# EAGLE design DIY_Keyboard_V1.4 (EAGLE 7.7.0)
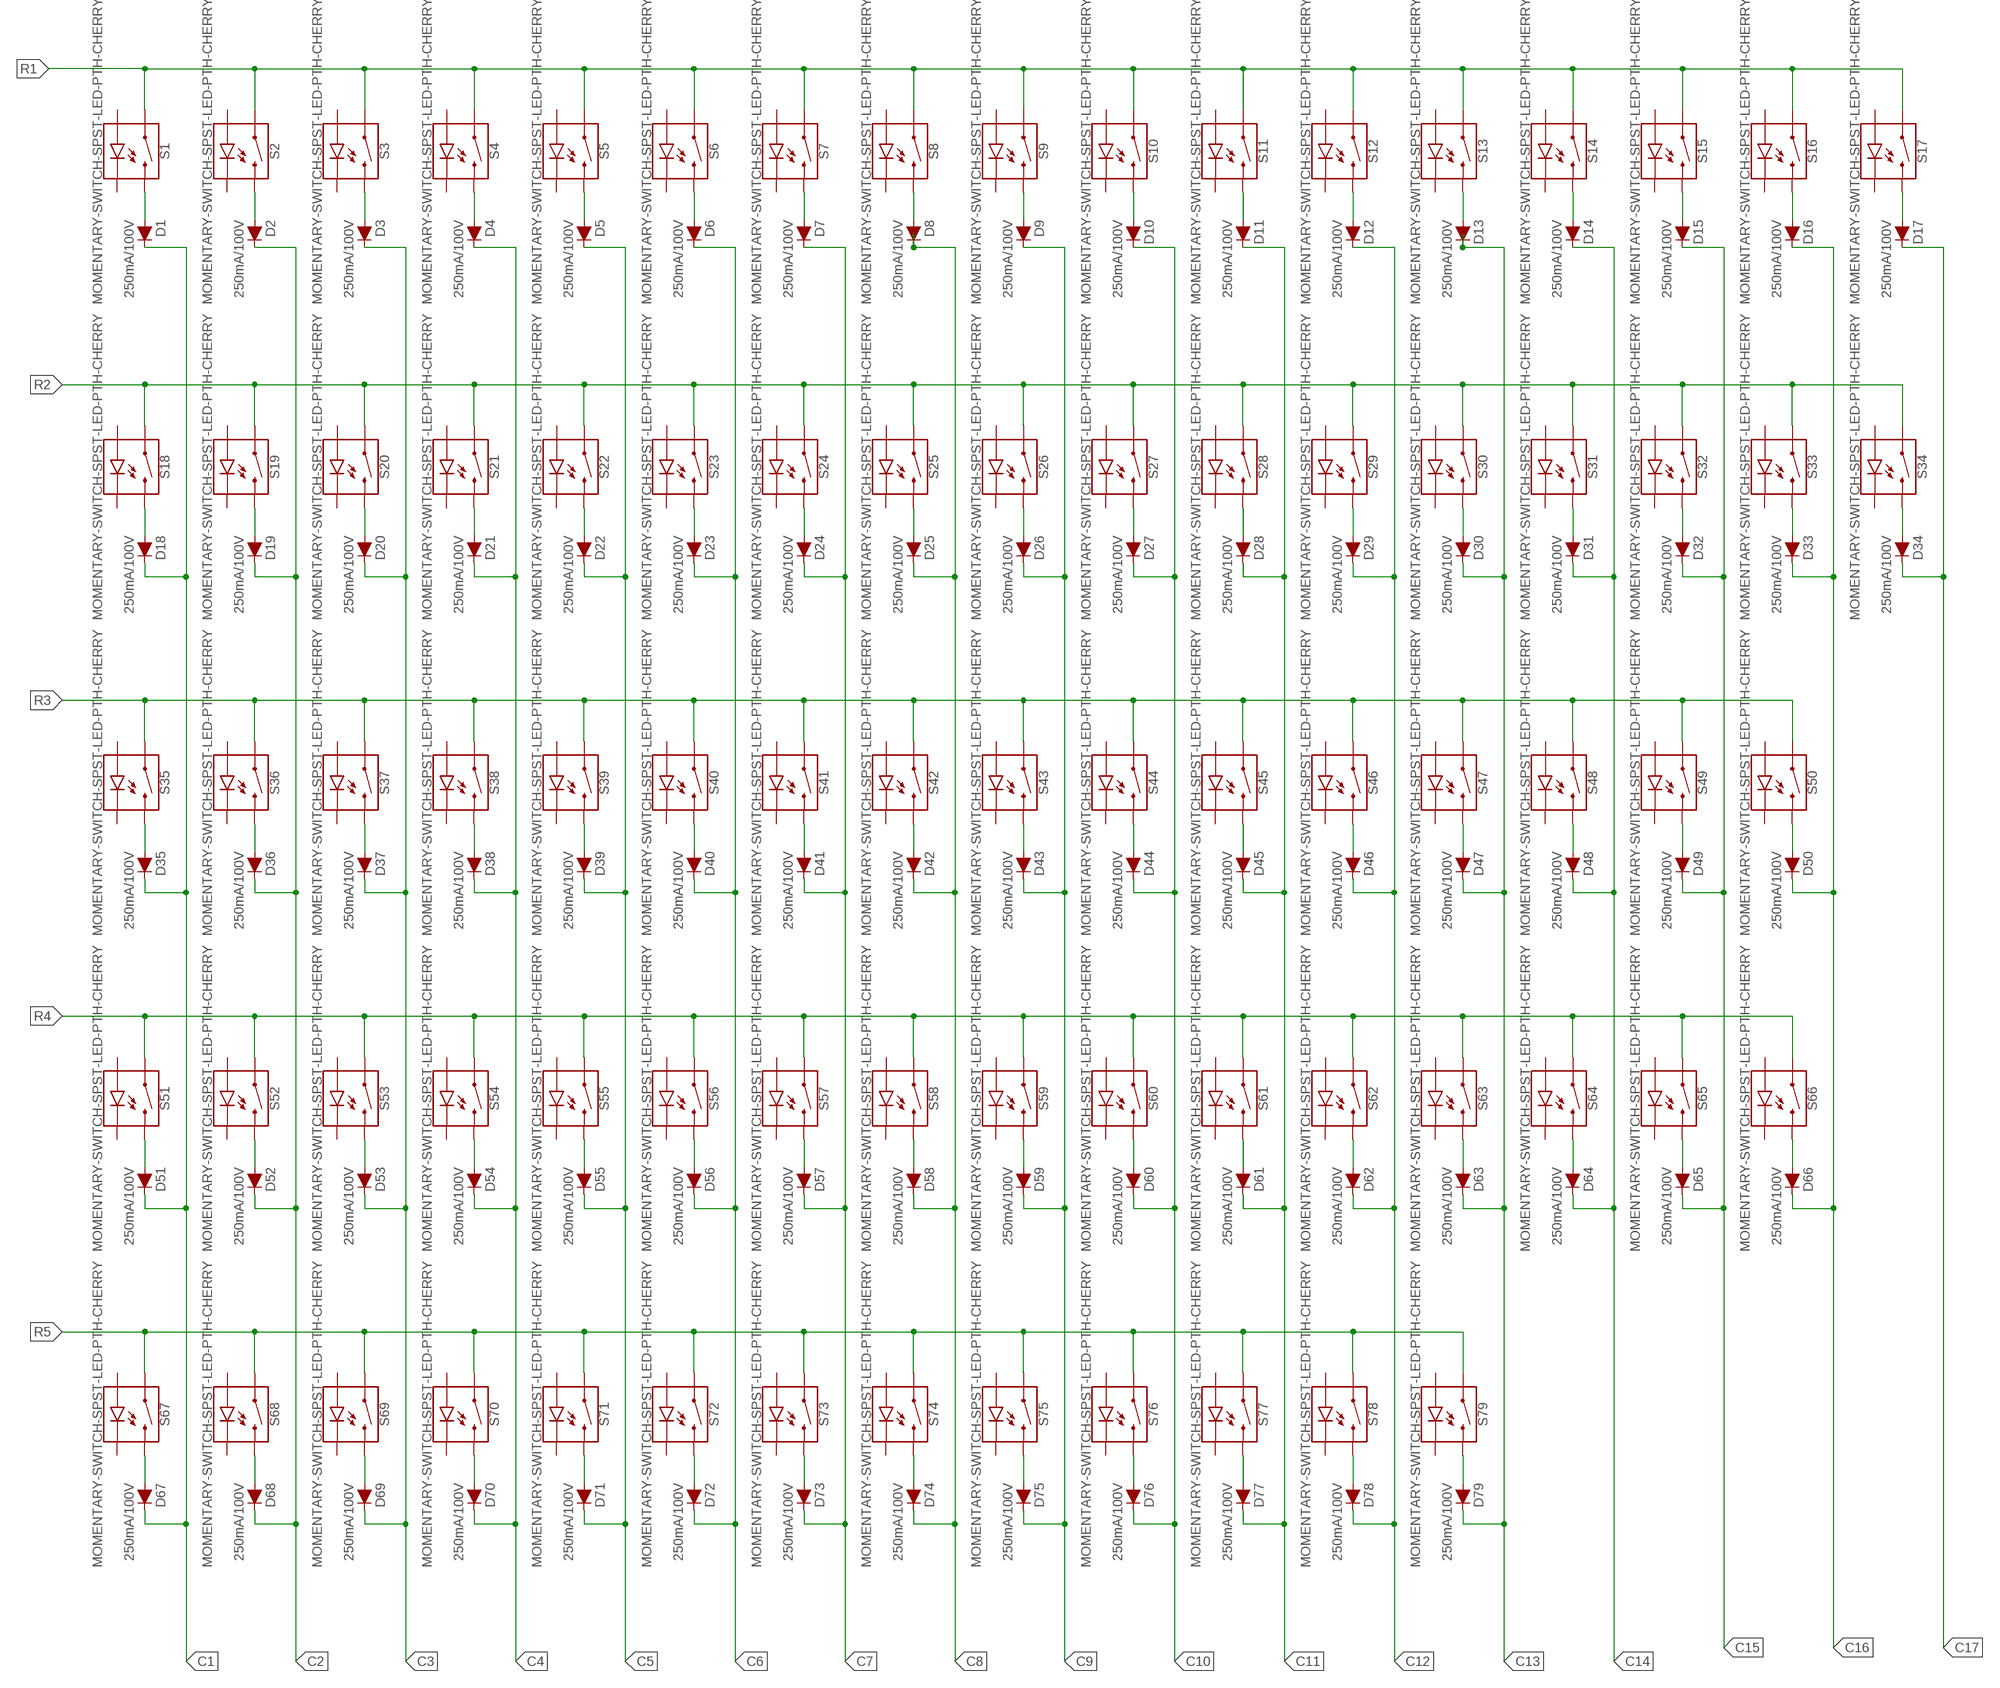
[diagram p0: schematic, sheet 1, part 1 of 2]
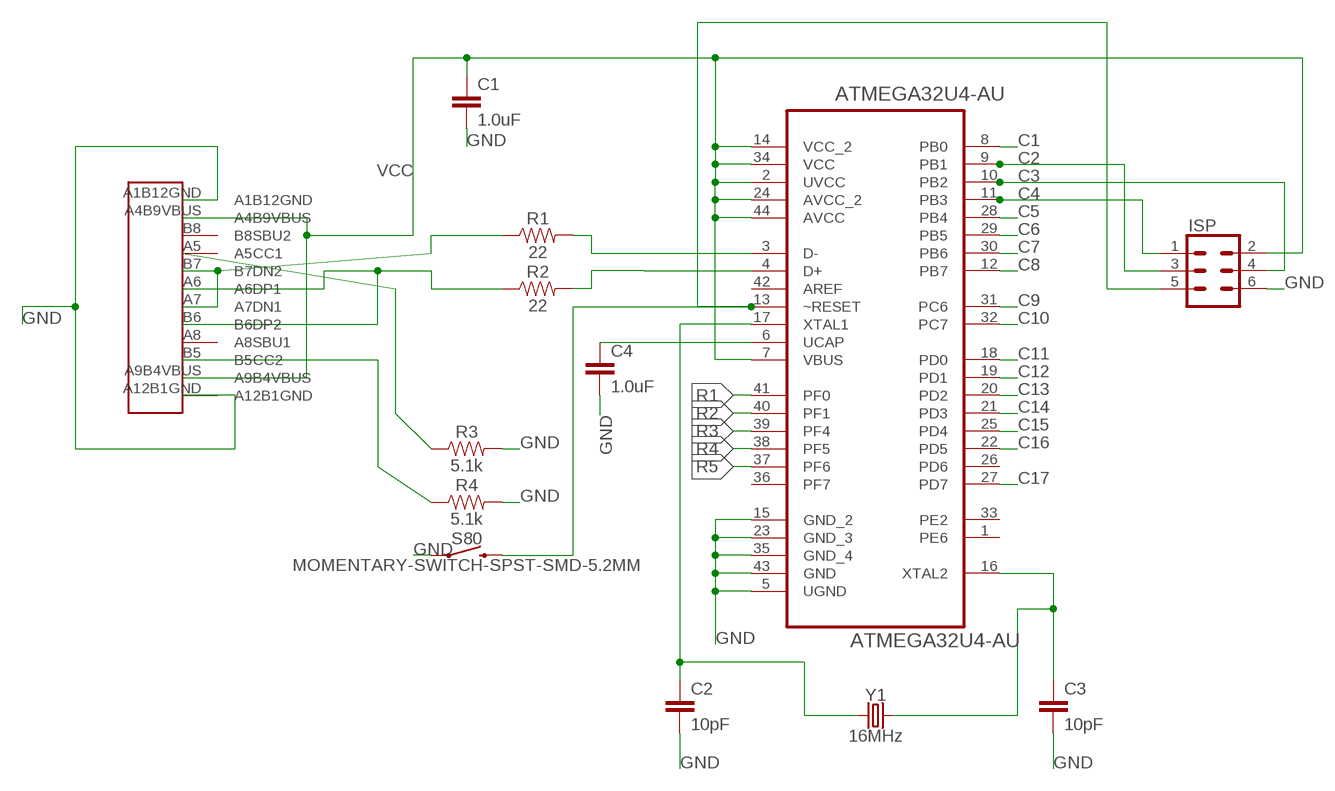
[diagram p1: schematic, sheet 1, part 2 of 2]

## Parts
ATMEGA32U4-AU  ATMEGA32U4-AU  [QFP80P1200X1200X120-44N]
C1  1.0uF  1.0UF-0603-16V-10%  [0603]
C2  10pF  10PF-0603-50V-5%  [0603]
C3  10pF  10PF-0603-50V-5%  [0603]
C4  1.0uF  1.0UF-0603-16V-10%  [0603]
D1  250mA/100V  DIODE-BAS16J  [SOD-323]
D2  250mA/100V  DIODE-BAS16J  [SOD-323]
D3  250mA/100V  DIODE-BAS16J  [SOD-323]
D4  250mA/100V  DIODE-BAS16J  [SOD-323]
D5  250mA/100V  DIODE-BAS16J  [SOD-323]
D6  250mA/100V  DIODE-BAS16J  [SOD-323]
D7  250mA/100V  DIODE-BAS16J  [SOD-323]
D8  250mA/100V  DIODE-BAS16J  [SOD-323]
D9  250mA/100V  DIODE-BAS16J  [SOD-323]
D10  250mA/100V  DIODE-BAS16J  [SOD-323]
D11  250mA/100V  DIODE-BAS16J  [SOD-323]
D12  250mA/100V  DIODE-BAS16J  [SOD-323]
D13  250mA/100V  DIODE-BAS16J  [SOD-323]
D14  250mA/100V  DIODE-BAS16J  [SOD-323]
D15  250mA/100V  DIODE-BAS16J  [SOD-323]
D16  250mA/100V  DIODE-BAS16J  [SOD-323]
D17  250mA/100V  DIODE-BAS16J  [SOD-323]
D18  250mA/100V  DIODE-BAS16J  [SOD-323]
D19  250mA/100V  DIODE-BAS16J  [SOD-323]
D20  250mA/100V  DIODE-BAS16J  [SOD-323]
D21  250mA/100V  DIODE-BAS16J  [SOD-323]
D22  250mA/100V  DIODE-BAS16J  [SOD-323]
D23  250mA/100V  DIODE-BAS16J  [SOD-323]
D24  250mA/100V  DIODE-BAS16J  [SOD-323]
D25  250mA/100V  DIODE-BAS16J  [SOD-323]
D26  250mA/100V  DIODE-BAS16J  [SOD-323]
D27  250mA/100V  DIODE-BAS16J  [SOD-323]
D28  250mA/100V  DIODE-BAS16J  [SOD-323]
D29  250mA/100V  DIODE-BAS16J  [SOD-323]
D30  250mA/100V  DIODE-BAS16J  [SOD-323]
D31  250mA/100V  DIODE-BAS16J  [SOD-323]
D32  250mA/100V  DIODE-BAS16J  [SOD-323]
D33  250mA/100V  DIODE-BAS16J  [SOD-323]
D34  250mA/100V  DIODE-BAS16J  [SOD-323]
D35  250mA/100V  DIODE-BAS16J  [SOD-323]
D36  250mA/100V  DIODE-BAS16J  [SOD-323]
D37  250mA/100V  DIODE-BAS16J  [SOD-323]
D38  250mA/100V  DIODE-BAS16J  [SOD-323]
D39  250mA/100V  DIODE-BAS16J  [SOD-323]
D40  250mA/100V  DIODE-BAS16J  [SOD-323]
D41  250mA/100V  DIODE-BAS16J  [SOD-323]
D42  250mA/100V  DIODE-BAS16J  [SOD-323]
D43  250mA/100V  DIODE-BAS16J  [SOD-323]
D44  250mA/100V  DIODE-BAS16J  [SOD-323]
D45  250mA/100V  DIODE-BAS16J  [SOD-323]
D46  250mA/100V  DIODE-BAS16J  [SOD-323]
D47  250mA/100V  DIODE-BAS16J  [SOD-323]
D48  250mA/100V  DIODE-BAS16J  [SOD-323]
D49  250mA/100V  DIODE-BAS16J  [SOD-323]
D50  250mA/100V  DIODE-BAS16J  [SOD-323]
D51  250mA/100V  DIODE-BAS16J  [SOD-323]
D52  250mA/100V  DIODE-BAS16J  [SOD-323]
D53  250mA/100V  DIODE-BAS16J  [SOD-323]
D54  250mA/100V  DIODE-BAS16J  [SOD-323]
D55  250mA/100V  DIODE-BAS16J  [SOD-323]
D56  250mA/100V  DIODE-BAS16J  [SOD-323]
D57  250mA/100V  DIODE-BAS16J  [SOD-323]
D58  250mA/100V  DIODE-BAS16J  [SOD-323]
D59  250mA/100V  DIODE-BAS16J  [SOD-323]
D60  250mA/100V  DIODE-BAS16J  [SOD-323]
D61  250mA/100V  DIODE-BAS16J  [SOD-323]
D62  250mA/100V  DIODE-BAS16J  [SOD-323]
D63  250mA/100V  DIODE-BAS16J  [SOD-323]
D64  250mA/100V  DIODE-BAS16J  [SOD-323]
D65  250mA/100V  DIODE-BAS16J  [SOD-323]
D66  250mA/100V  DIODE-BAS16J  [SOD-323]
D67  250mA/100V  DIODE-BAS16J  [SOD-323]
D68  250mA/100V  DIODE-BAS16J  [SOD-323]
D69  250mA/100V  DIODE-BAS16J  [SOD-323]
D70  250mA/100V  DIODE-BAS16J  [SOD-323]
D71  250mA/100V  DIODE-BAS16J  [SOD-323]
D72  250mA/100V  DIODE-BAS16J  [SOD-323]
D73  250mA/100V  DIODE-BAS16J  [SOD-323]
D74  250mA/100V  DIODE-BAS16J  [SOD-323]
D75  250mA/100V  DIODE-BAS16J  [SOD-323]
D76  250mA/100V  DIODE-BAS16J  [SOD-323]
D77  250mA/100V  DIODE-BAS16J  [SOD-323]
D78  250mA/100V  DIODE-BAS16J  [SOD-323]
D79  250mA/100V  DIODE-BAS16J  [SOD-323]
ISP  CONN_03X2FEMALE  [2X3]
R1  22  22OHM-0603-1/10W-1%  [0603]
R2  22  22OHM-0603-1/10W-1%  [0603]
R3  5.1k  56KOHM  [0603]
R4  5.1k  56KOHM  [0603]
S1  MOMENTARY-SWITCH-SPST-LED-PTH-CHERRY  [CHERRY-MX-LED]
S2  MOMENTARY-SWITCH-SPST-LED-PTH-CHERRY  [CHERRY-MX-LED]
S3  MOMENTARY-SWITCH-SPST-LED-PTH-CHERRY  [CHERRY-MX-LED]
S4  MOMENTARY-SWITCH-SPST-LED-PTH-CHERRY  [CHERRY-MX-LED]
S5  MOMENTARY-SWITCH-SPST-LED-PTH-CHERRY  [CHERRY-MX-LED]
S6  MOMENTARY-SWITCH-SPST-LED-PTH-CHERRY  [CHERRY-MX-LED]
S7  MOMENTARY-SWITCH-SPST-LED-PTH-CHERRY  [CHERRY-MX-LED]
S8  MOMENTARY-SWITCH-SPST-LED-PTH-CHERRY  [CHERRY-MX-LED]
S9  MOMENTARY-SWITCH-SPST-LED-PTH-CHERRY  [CHERRY-MX-LED]
S10  MOMENTARY-SWITCH-SPST-LED-PTH-CHERRY  [CHERRY-MX-LED]
S11  MOMENTARY-SWITCH-SPST-LED-PTH-CHERRY  [CHERRY-MX-LED]
S12  MOMENTARY-SWITCH-SPST-LED-PTH-CHERRY  [CHERRY-MX-LED]
S13  MOMENTARY-SWITCH-SPST-LED-PTH-CHERRY  [CHERRY-MX-LED]
S14  MOMENTARY-SWITCH-SPST-LED-PTH-CHERRY  [CHERRY-MX-LED]
S15  MOMENTARY-SWITCH-SPST-LED-PTH-CHERRY  [CHERRY-MX-LED]
S16  MOMENTARY-SWITCH-SPST-LED-PTH-CHERRY  [CHERRY-MX-LED]
S17  MOMENTARY-SWITCH-SPST-LED-PTH-CHERRY  [CHERRY-MX-LED]
S18  MOMENTARY-SWITCH-SPST-LED-PTH-CHERRY  [CHERRY-MX-LED]
S19  MOMENTARY-SWITCH-SPST-LED-PTH-CHERRY  [CHERRY-MX-LED]
S20  MOMENTARY-SWITCH-SPST-LED-PTH-CHERRY  [CHERRY-MX-LED]
S21  MOMENTARY-SWITCH-SPST-LED-PTH-CHERRY  [CHERRY-MX-LED]
S22  MOMENTARY-SWITCH-SPST-LED-PTH-CHERRY  [CHERRY-MX-LED]
S23  MOMENTARY-SWITCH-SPST-LED-PTH-CHERRY  [CHERRY-MX-LED]
S24  MOMENTARY-SWITCH-SPST-LED-PTH-CHERRY  [CHERRY-MX-LED]
S25  MOMENTARY-SWITCH-SPST-LED-PTH-CHERRY  [CHERRY-MX-LED]
S26  MOMENTARY-SWITCH-SPST-LED-PTH-CHERRY  [CHERRY-MX-LED]
S27  MOMENTARY-SWITCH-SPST-LED-PTH-CHERRY  [CHERRY-MX-LED]
S28  MOMENTARY-SWITCH-SPST-LED-PTH-CHERRY  [CHERRY-MX-LED]
S29  MOMENTARY-SWITCH-SPST-LED-PTH-CHERRY  [CHERRY-MX-LED]
S30  MOMENTARY-SWITCH-SPST-LED-PTH-CHERRY  [CHERRY-MX-LED]
S31  MOMENTARY-SWITCH-SPST-LED-PTH-CHERRY  [CHERRY-MX-LED]
S32  MOMENTARY-SWITCH-SPST-LED-PTH-CHERRY  [CHERRY-MX-LED]
S33  MOMENTARY-SWITCH-SPST-LED-PTH-CHERRY  [CHERRY-MX-LED]
S34  MOMENTARY-SWITCH-SPST-LED-PTH-CHERRY  [CHERRY-MX-LED]
S35  MOMENTARY-SWITCH-SPST-LED-PTH-CHERRY  [CHERRY-MX-LED]
S36  MOMENTARY-SWITCH-SPST-LED-PTH-CHERRY  [CHERRY-MX-LED]
S37  MOMENTARY-SWITCH-SPST-LED-PTH-CHERRY  [CHERRY-MX-LED]
S38  MOMENTARY-SWITCH-SPST-LED-PTH-CHERRY  [CHERRY-MX-LED]
S39  MOMENTARY-SWITCH-SPST-LED-PTH-CHERRY  [CHERRY-MX-LED]
S40  MOMENTARY-SWITCH-SPST-LED-PTH-CHERRY  [CHERRY-MX-LED]
S41  MOMENTARY-SWITCH-SPST-LED-PTH-CHERRY  [CHERRY-MX-LED]
S42  MOMENTARY-SWITCH-SPST-LED-PTH-CHERRY  [CHERRY-MX-LED]
S43  MOMENTARY-SWITCH-SPST-LED-PTH-CHERRY  [CHERRY-MX-LED]
S44  MOMENTARY-SWITCH-SPST-LED-PTH-CHERRY  [CHERRY-MX-LED]
S45  MOMENTARY-SWITCH-SPST-LED-PTH-CHERRY  [CHERRY-MX-LED]
S46  MOMENTARY-SWITCH-SPST-LED-PTH-CHERRY  [CHERRY-MX-LED]
S47  MOMENTARY-SWITCH-SPST-LED-PTH-CHERRY  [CHERRY-MX-LED]
S48  MOMENTARY-SWITCH-SPST-LED-PTH-CHERRY  [CHERRY-MX-LED]
S49  MOMENTARY-SWITCH-SPST-LED-PTH-CHERRY  [CHERRY-MX-LED]
S50  MOMENTARY-SWITCH-SPST-LED-PTH-CHERRY  [CHERRY-MX-LED]
S51  MOMENTARY-SWITCH-SPST-LED-PTH-CHERRY  [CHERRY-MX-LED]
S52  MOMENTARY-SWITCH-SPST-LED-PTH-CHERRY  [CHERRY-MX-LED]
S53  MOMENTARY-SWITCH-SPST-LED-PTH-CHERRY  [CHERRY-MX-LED]
S54  MOMENTARY-SWITCH-SPST-LED-PTH-CHERRY  [CHERRY-MX-LED]
S55  MOMENTARY-SWITCH-SPST-LED-PTH-CHERRY  [CHERRY-MX-LED]
S56  MOMENTARY-SWITCH-SPST-LED-PTH-CHERRY  [CHERRY-MX-LED]
S57  MOMENTARY-SWITCH-SPST-LED-PTH-CHERRY  [CHERRY-MX-LED]
S58  MOMENTARY-SWITCH-SPST-LED-PTH-CHERRY  [CHERRY-MX-LED]
S59  MOMENTARY-SWITCH-SPST-LED-PTH-CHERRY  [CHERRY-MX-LED]
S60  MOMENTARY-SWITCH-SPST-LED-PTH-CHERRY  [CHERRY-MX-LED]
S61  MOMENTARY-SWITCH-SPST-LED-PTH-CHERRY  [CHERRY-MX-LED]
S62  MOMENTARY-SWITCH-SPST-LED-PTH-CHERRY  [CHERRY-MX-LED]
S63  MOMENTARY-SWITCH-SPST-LED-PTH-CHERRY  [CHERRY-MX-LED]
S64  MOMENTARY-SWITCH-SPST-LED-PTH-CHERRY  [CHERRY-MX-LED]
S65  MOMENTARY-SWITCH-SPST-LED-PTH-CHERRY  [CHERRY-MX-LED]
S66  MOMENTARY-SWITCH-SPST-LED-PTH-CHERRY  [CHERRY-MX-LED]
S67  MOMENTARY-SWITCH-SPST-LED-PTH-CHERRY  [CHERRY-MX-LED]
S68  MOMENTARY-SWITCH-SPST-LED-PTH-CHERRY  [CHERRY-MX-LED]
S69  MOMENTARY-SWITCH-SPST-LED-PTH-CHERRY  [CHERRY-MX-LED]
S70  MOMENTARY-SWITCH-SPST-LED-PTH-CHERRY  [CHERRY-MX-LED]
S71  MOMENTARY-SWITCH-SPST-LED-PTH-CHERRY  [CHERRY-MX-LED]
S72  MOMENTARY-SWITCH-SPST-LED-PTH-CHERRY  [CHERRY-MX-LED]
S73  MOMENTARY-SWITCH-SPST-LED-PTH-CHERRY  [CHERRY-MX-LED]
S74  MOMENTARY-SWITCH-SPST-LED-PTH-CHERRY  [CHERRY-MX-LED]
S75  MOMENTARY-SWITCH-SPST-LED-PTH-CHERRY  [CHERRY-MX-LED]
S76  MOMENTARY-SWITCH-SPST-LED-PTH-CHERRY  [CHERRY-MX-LED]
S77  MOMENTARY-SWITCH-SPST-LED-PTH-CHERRY  [CHERRY-MX-LED]
S78  MOMENTARY-SWITCH-SPST-LED-PTH-CHERRY  [CHERRY-MX-LED]
S79  MOMENTARY-SWITCH-SPST-LED-PTH-CHERRY  [CHERRY-MX-LED]
S80  MOMENTARY-SWITCH-SPST-SMD-5.2MM  [TACTILE_SWITCH_SMD_5.2MM]
U$1  USB_TYPE_C  [USB_TYPE_C]
Y1  16MHz  CRYSTAL-16MHZSMD-5X3.2  [CRYSTAL-SMD-5X3.2-4PAD]

## Nets
C1: ATMEGA32U4-AU.8(PB0) D1.C D18.C D35.C D51.C D67.C
C2: ATMEGA32U4-AU.9(PB1) D2.C D19.C D36.C D52.C D68.C ISP.3
C3: ATMEGA32U4-AU.10(PB2) D3.C D20.C D37.C D53.C D69.C ISP.4
C4: ATMEGA32U4-AU.11(PB3) D4.C D21.C D38.C D54.C D70.C ISP.1
C5: ATMEGA32U4-AU.28(PB4) D5.C D22.C D39.C D55.C D71.C
C6: ATMEGA32U4-AU.29(PB5) D6.C D23.C D40.C D56.C D72.C
C7: ATMEGA32U4-AU.30(PB6) D7.C D24.C D41.C D57.C D73.C
C8: ATMEGA32U4-AU.12(PB7) D8.C D25.C D42.C D58.C D74.C
C9: ATMEGA32U4-AU.31(PC6) D9.C D26.C D43.C D59.C D75.C
C10: ATMEGA32U4-AU.32(PC7) D10.C D27.C D44.C D60.C D76.C
C11: ATMEGA32U4-AU.18(PD0) D11.C D28.C D45.C D61.C D77.C
C12: ATMEGA32U4-AU.19(PD1) D12.C D29.C D46.C D62.C D78.C
C13: ATMEGA32U4-AU.20(PD2) D13.C D30.C D47.C D63.C D79.C
C14: ATMEGA32U4-AU.21(PD3) D14.C D31.C D48.C D64.C
C15: ATMEGA32U4-AU.25(PD4) D15.C D32.C D49.C D65.C
C16: ATMEGA32U4-AU.22(PD5) D16.C D33.C D50.C D66.C
C17: ATMEGA32U4-AU.27(PD7) D17.C D34.C
GND: ATMEGA32U4-AU.5(UGND) ATMEGA32U4-AU.15(GND_2) ATMEGA32U4-AU.23(GND_3) ATMEGA32U4-AU.35(GND_4) ATMEGA32U4-AU.43(GND) C1.2 C2.2 C3.2 C4.2 ISP.6 R3.2 R4.2 S80.1 U$1.A1B12GND U$1.A12B1GND
N$1: D1.A S1.S2
N$2: D2.A S2.S2
N$3: D3.A S3.S2
N$4: D4.A S4.S2
N$5: D5.A S5.S2
N$6: D6.A S6.S2
N$7: D7.A S7.S2
N$8: D8.A S8.S2
N$9: D9.A S9.S2
N$10: D10.A S10.S2
N$11: D11.A S11.S2
N$12: D12.A S12.S2
N$13: D13.A S13.S2
N$14: D14.A S14.S2
N$15: D15.A S15.S2
N$16: D16.A S16.S2
N$17: D17.A S17.S2
N$18: D18.A S18.S2
N$19: D19.A S19.S2
N$20: D20.A S20.S2
N$21: D21.A S21.S2
N$22: D22.A S22.S2
N$23: D23.A S23.S2
N$24: D24.A S24.S2
N$25: D25.A S25.S2
N$26: D26.A S26.S2
N$27: D27.A S27.S2
N$28: D28.A S28.S2
N$29: D29.A S29.S2
N$30: D30.A S30.S2
N$31: D31.A S31.S2
N$32: D32.A S32.S2
N$33: D33.A S33.S2
N$34: D34.A S34.S2
N$35: D35.A S35.S2
N$36: D36.A S36.S2
N$37: D37.A S37.S2
N$38: D38.A S38.S2
N$39: D39.A S39.S2
N$40: D40.A S40.S2
N$41: D41.A S41.S2
N$42: D42.A S42.S2
N$43: D43.A S43.S2
N$44: D44.A S44.S2
N$45: D45.A S45.S2
N$46: D46.A S46.S2
N$47: D47.A S47.S2
N$48: D48.A S48.S2
N$49: D49.A S49.S2
N$50: D50.A S50.S2
N$51: D51.A S51.S2
N$52: D52.A S52.S2
N$53: D53.A S53.S2
N$54: D54.A S54.S2
N$55: D55.A S55.S2
N$56: D56.A S56.S2
N$57: D57.A S57.S2
N$58: D58.A S58.S2
N$59: D59.A S59.S2
N$60: D60.A S60.S2
N$61: D61.A S61.S2
N$62: D62.A S62.S2
N$63: D63.A S63.S2
N$64: D64.A S64.S2
N$65: D65.A S65.S2
N$66: D66.A S66.S2
N$67: D67.A S67.S2
N$68: D68.A S68.S2
N$69: D69.A S69.S2
N$70: D70.A S70.S2
N$71: D71.A S71.S2
N$72: D72.A S72.S2
N$73: D73.A S73.S2
N$74: D74.A S74.S2
N$75: D75.A S75.S2
N$76: D76.A S76.S2
N$77: D77.A S77.S2
N$78: D78.A S78.S2
N$79: D79.A S79.S2
N$80: ATMEGA32U4-AU.3(D-) R1.2
N$81: ATMEGA32U4-AU.4(D+) R2.2
N$82: R1.1 U$1.A7(A7DN1) U$1.B7(B7DN2)
N$84: R2.1 U$1.A6(A6DP1) U$1.B6(B6DP2)
N$85: ATMEGA32U4-AU.13(~RESET) ISP.5 S80.3
N$86: ATMEGA32U4-AU.16(XTAL2) C3.1 Y1.3
N$87: ATMEGA32U4-AU.17(XTAL1) C2.1 Y1.1
N$88: R3.1 U$1.A5(A5CC1)
N$89: R4.1 U$1.B5(B5CC2)
N$92: ATMEGA32U4-AU.6(UCAP) C4.1
R1: ATMEGA32U4-AU.41(PF0) S1.S1 S2.S1 S3.S1 S4.S1 S5.S1 S6.S1 S7.S1 S8.S1 S9.S1 S10.S1 S11.S1 S12.S1 S13.S1 S14.S1 S15.S1 S16.S1 S17.S1
R2: ATMEGA32U4-AU.40(PF1) S18.S1 S19.S1 S20.S1 S21.S1 S22.S1 S23.S1 S24.S1 S25.S1 S26.S1 S27.S1 S28.S1 S29.S1 S30.S1 S31.S1 S32.S1 S33.S1 S34.S1
R3: ATMEGA32U4-AU.39(PF4) S35.S1 S36.S1 S37.S1 S38.S1 S39.S1 S40.S1 S41.S1 S42.S1 S43.S1 S44.S1 S45.S1 S46.S1 S47.S1 S48.S1 S49.S1 S50.S1
R4: ATMEGA32U4-AU.38(PF5) S51.S1 S52.S1 S53.S1 S54.S1 S55.S1 S56.S1 S57.S1 S58.S1 S59.S1 S60.S1 S61.S1 S62.S1 S63.S1 S64.S1 S65.S1 S66.S1
R5: ATMEGA32U4-AU.37(PF6) S67.S1 S68.S1 S69.S1 S70.S1 S71.S1 S72.S1 S73.S1 S74.S1 S75.S1 S76.S1 S77.S1 S78.S1 S79.S1
VCC: ATMEGA32U4-AU.2(UVCC) ATMEGA32U4-AU.7(VBUS) ATMEGA32U4-AU.14(VCC_2) ATMEGA32U4-AU.24(AVCC_2) ATMEGA32U4-AU.34(VCC) ATMEGA32U4-AU.44(AVCC) C1.1 ISP.2 U$1.A4B9VBUS U$1.A9B4VBUS
Unconnected: ATMEGA32U4-AU.1(PE6) ATMEGA32U4-AU.26(PD6) ATMEGA32U4-AU.33(PE2) ATMEGA32U4-AU.36(PF7) ATMEGA32U4-AU.42(AREF) S1.A S1.K(C) S2.A S2.K(C) S3.A S3.K(C) S4.A S4.K(C) S5.A S5.K(C) S6.A S6.K(C) S7.A S7.K(C) S8.A S8.K(C) S9.A S9.K(C) S10.A S10.K(C) S11.A S11.K(C) S12.A S12.K(C) S13.A S13.K(C) S14.A S14.K(C) S15.A S15.K(C) S16.A S16.K(C) S17.A S17.K(C) S18.A S18.K(C) S19.A S19.K(C) S20.A S20.K(C) S21.A S21.K(C) S22.A S22.K(C) S23.A S23.K(C) S24.A S24.K(C) S25.A S25.K(C) S26.A S26.K(C) S27.A S27.K(C) S28.A S28.K(C) S29.A S29.K(C) S30.A S30.K(C) S31.A S31.K(C) S32.A S32.K(C) S33.A S33.K(C) S34.A S34.K(C) S35.A S35.K(C) S36.A S36.K(C) S37.A S37.K(C) S38.A S38.K(C) S39.A S39.K(C) S40.A S40.K(C) S41.A S41.K(C) S42.A S42.K(C) S43.A S43.K(C) S44.A S44.K(C) S45.A S45.K(C) S46.A S46.K(C) S47.A S47.K(C) S48.A S48.K(C) S49.A S49.K(C) S50.A S50.K(C) S51.A S51.K(C) S52.A S52.K(C) S53.A S53.K(C) S54.A S54.K(C) S55.A S55.K(C) S56.A S56.K(C) S57.A S57.K(C) S58.A S58.K(C) S59.A S59.K(C) S60.A S60.K(C) S61.A S61.K(C) S62.A S62.K(C) S63.A S63.K(C) S64.A S64.K(C) S65.A S65.K(C) S66.A S66.K(C) S67.A S67.K(C) S68.A S68.K(C) S69.A S69.K(C) S70.A S70.K(C) S71.A S71.K(C) S72.A S72.K(C) S73.A S73.K(C) S74.A S74.K(C) S75.A S75.K(C) S76.A S76.K(C) S77.A S77.K(C) S78.A S78.K(C) S79.A S79.K(C) U$1.A8(A8SBU1) U$1.B8(B8SBU2)

## Library data of the parts
ATMEGA32U4-AU = ATMEGA32U4-AU:ATMEGA32U4-AU: 8-bit Microcontroller with ISP Flash and USB Controller; AVAILABILITY: Unavailable; DESCRIPTION: MCU 8-bit ATmega AVR RISC 32KB Flash 3.3V/5V 44-Pin TQFP; MF: Microchip; MP: ATMEGA32U4-AU; PACKAGE: TQFP-44 Microchip; PRICE: None
C1 C4 = SparkFun-Capacitors:1.0UF: 1µF ceramic capacitors A capacitor is a passive two-terminal electrical component used to store electrical energy temporarily in an electric field.; PROD_ID: CAP-00868
C2 C3 = SparkFun-Capacitors:10PF: 10pF ceramic capacitors A capacitor is a passive two-terminal electrical component used to store electrical energy temporarily in an electric field.; PROD_ID: CAP-11812
D1-D79 = SparkFun-DiscreteSemi:DIODE: Diode These are standard reverse protection diodes and small signal diodes. SparkFun Products: SparkFun SparkPunk Sound Kit <https://www.sparkfun.com/products/11177> SparkFun ESP8266 Thing <https://www.sparkfun.com/products/13231>; PROD_ID: DIO-09646
ISP = SparkFun-Connectors:CONN_03X2: Multi connection point. Often used as Generic Header-pin footprint for 0.1 inch spaced/style header connections You can populate with any combo of single row headers, but if you'd like an exact match, check these: Header - 2x3 (Male, 0.1") <https://www.sparkfun.com/products/12807> (PRT-12807) Header - 2x3 (Female, 0.1") <https://www.sparkfun.com/products/13010> (PRT-13010) 2x3 Pin Shrouded Header <https://www.sparkfun.com/products/10877> (PRT-10877) On any of the 0.1 inch spaced packages, you can populate with these: Break Away Headers - Straight <https://www.sparkfun.com/products/116> (PRT-00116) Break Away Male Headers - Right Angle <https://www.sparkfun.com/products/553> (PRT-00553) Female Headers <https://www.sparkfun.com/products/115> (PRT-00115) Break Away Headers - Machine Pin <https://www.sparkfun.com/products/117> (PRT-00117) Break Away Female Headers - Swiss Machine Pin <https://www.sparkfun.com/products/743> (PRT-00743) Special note: the shrouded connector mates well with our 3x2 ribbon cables: Ribbon Crimp Connector - 6-pin (2x3, Female) <https://www.sparkfun.com/products/10651> (PRT-10651) Ribbon Cable - 6 wire (15ft) <https://www.sparkfun.com/products/10646> (PRT-10646); PROD_ID: CONN-11566; VALUE: FEMALE 2x3
R1 R2 = SparkFun-Resistors:22OHM: 22Ω resistor A resistor is a passive two-terminal electrical component that implements electrical resistance as a circuit element. Resistors act to reduce current flow, and, at the same time, act to lower voltage levels within circuits. - Wikipedia; PROD_ID: RES-08698
R3 R4 = SparkFun-Resistors:56KOHM; VALUE: 56k
S1-S79 = SparkFun-Switches:MOMENTARY-SWITCH-SPST-LED: Momentary Switch (Pushbutton) - SPST - w/ LED Normally-open (NO) SPST momentary switches (buttons, pushbuttons), with a built-in LED. Variants PTH-CHERRY - Cherry MX Switch Cherry MX Keyswitches are top-of-the-line mechanical keyboard switches. They’re satisfyingly “clicky”, reliable up to tens-of-millions of key presses, and a standard in gaming and programming keyboards across the globe. This ‘blue’ version Cherry MX Switch is favored by most due to its secondary internal actuator making it less likely to “double-tap.” If you are looking for a noticeably audible and high-quality key switch, this is the perfect option for you! Cherry MX Switch <https://www.sparkfun.com/products/13834> (COM-13834) Cherry MX Switch Breakout <https://www.sparkfun.com/products/13773> (BOB-13773) PTH-12MM and PTH-12MM-KIT - 12mm Illuminated LED KIT variant is for soldering kits. There is no tStop (covering up the top side of the pads with mask). This helps the beginner see which side they should be soldering too. LED Tactile Button Breakout <https://www.sparkfun.com/products/10467> (BOB-10467) LED Tactile Button - Red <https://www.sparkfun.com/products/10442> (COM-10442) LED Tactile Button - Blue <https://www.sparkfun.com/products/10443> (COM-10443) LED Tactile Button - Green <https://www.sparkfun.com/products/10440> (COM-10440) LED Tactile Button - Orange <https://www.sparkfun.com/products/10441> (COM-10441) LED Tactile Button - White <https://www.sparkfun.com/products/10439> (COM-10439); SF_ID: COM-13834
S80 = SparkFun-Switches:MOMENTARY-SWITCH-SPST: Momentary Switch (Pushbutton) - SPST Normally-open (NO) SPST momentary switches (buttons, pushbuttons). Variants PTH-12MM - 12mm square, through-hole Momentary Pushbutton Switch - 12mm Square <https://www.sparkfun.com/products/9190> (COM-09190) PTH-6.0MM, PTH-6.0MM-KIT - 6.0mm square, through-hole Mini Pushbutton Switch <https://www.sparkfun.com/products/97> (COM-00097) KIT package intended for soldering kit's - only one side of pads' copper is exposed. PTH-RIGHT-ANGLE-KIT - Right-angle, through-hole Right Angle Tactile Button <https://www.sparkfun.com/products/10791> - Used on SparkFun BigTime Watch Kit <https://www.sparkfun.com/products/11734> SMD-12MM - 12mm square, surface-mount Tactile Button - SMD (12mm) <https://www.sparkfun.com/products/12993> (COM-12993) Used on SparkFun PicoBoard <https://www.sparkfun.com/products/11888> SMD-4.5MM - 4.5mm Square Trackball Switch Used on SparkFun Blackberry Trackballer Breakout <https://www.sparkfun.com/products/13169> SMD-4.6MMX2.8MM - 4.60mm x 2.80mm, surface mount Used on SparkFun SAMD21 Mini Breakout <https://www.sparkfun.com/products/13664> SMD-5.2MM, SMD-5.2-REDUNDANT - 5.2mm square, surface-mount Mini Pushbutton Switch - SMD <https://www.sparkfun.com/products/8720> (COM-08720) Used on Arduino Pro Mini <https://www.sparkfun.com/products/11114> REDUNDANT package connects both switch circuits together SMD-6.0X3.5MM - 6.0 x 3.5mm, surface mount Momentary Reset Switch SMD <https://www.sparkfun.com/products/8229> (COM-08229) SMD-6.2MM-TALL - 6.2mm square, surface mount Tactile Button - SMD (6mm) <https://www.sparkfun.com/products/12992> Used on SparkFun Digital Sandbox <https://www.sparkfun.com/products/12651> SMD-RIGHT-ANGLE - Right-angle, surface mount Used on SparkFun Block for Intel® Edison - Arduino <https://www.sparkfun.com/products/13036>; PROD_ID: SWCH-08247; SF_SKU: COM-08720
U$1 = USB-TYPE-C-V2:USB_TYPE_C
Y1 = SparkFun-Clocks:CRYSTAL-16MHZ: 16MHz Crystal Digikey Example <http://www.digikey.com/product-search/en?keywords=535-9122-1-ND> Frequency: 16MHz Frequency Stability: ±50ppm Frequency Tolerance: ±20ppm Load Capacitance: 18pF SparkFun Products: Pro Micro -5V/16MHz <https://www.sparkfun.com/products/12640> SparkFun Serial Enabled LCD Kit <https://www.sparkfun.com/products/10097>; PROD_ID: XTAL-08218; SF_ID: COM-00094

## Board
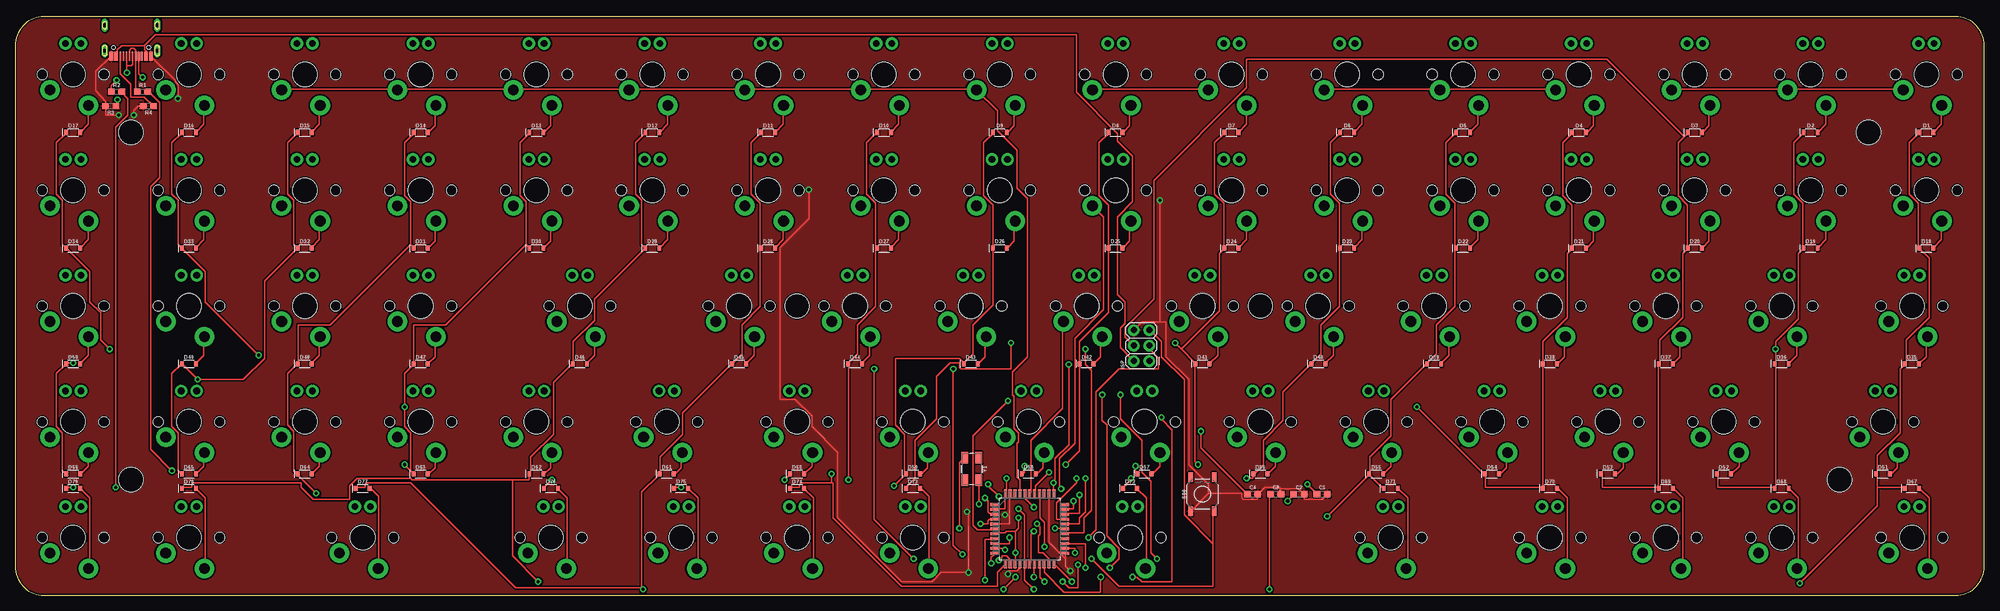
[diagram p2: board, top side]
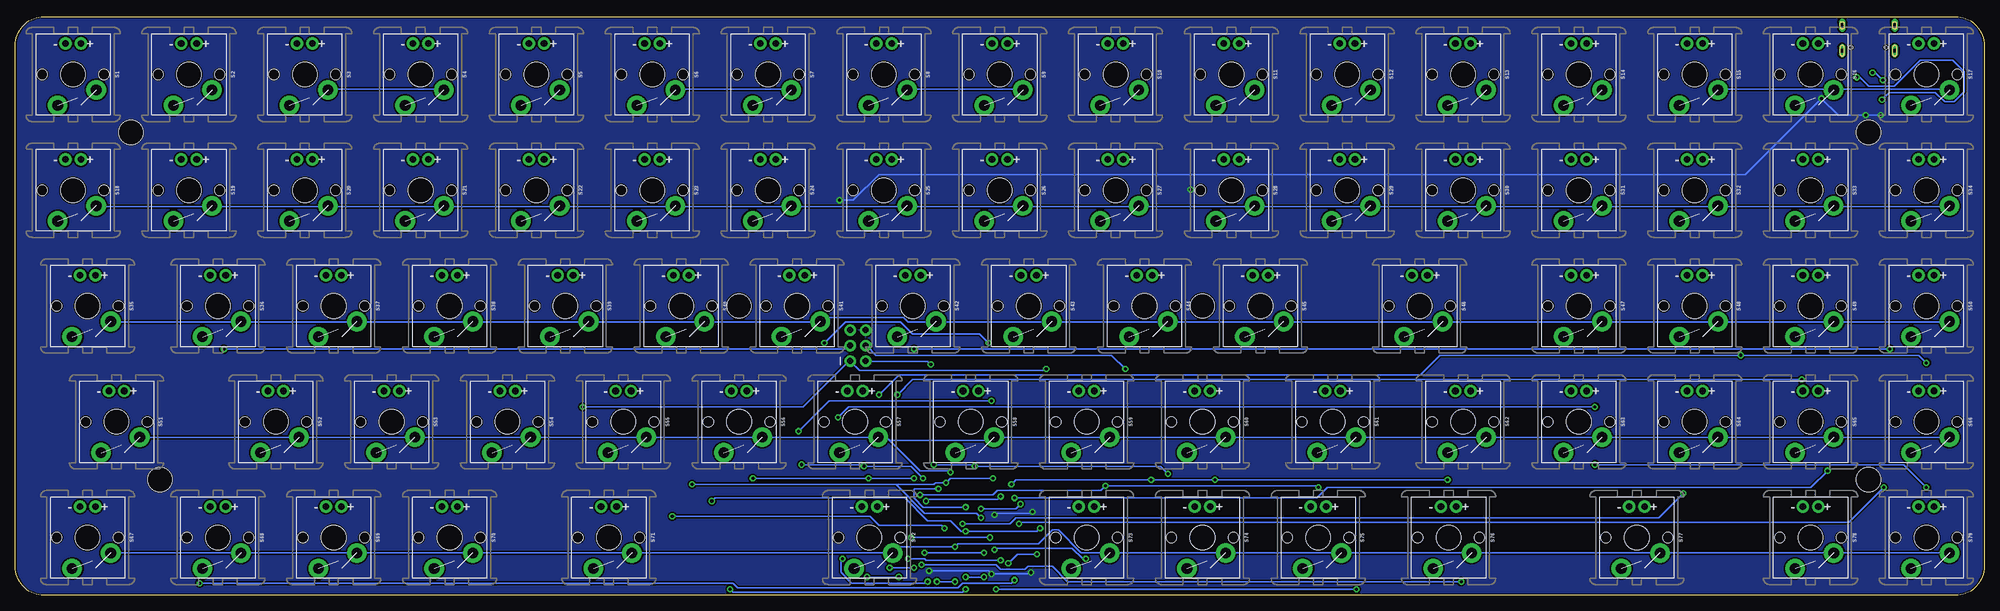
[diagram p3: board, bottom side, seen from below]

Size 323.85 x 95.25 mm. Coordinates in mm from the lower left corner, seen from the top.
Outline: 323.85,4.76 323.85,90.49 arc90 319.09,95.25 4.76,95.25 arc90 0,90.49 0,4.76 arc90 4.76,0 319.09,0 arc90 323.85,4.76
Copper layers (1*16): Top 0.035mm / dielectric 1.5mm / Bottom 0.035mm
Design rules "SparkFun-2-layer-STANDARD": minimum track width 10mil, minimum drill 20mil, track to track 10mil, track to pad 8mil, pad to pad 8mil, via to via 10mil, smd to smd 8mil, copper to edge 8mil, drill to drill 8mil, minimum pad ring 10mil, minimum via ring 10mil, stop-mask expansion 4mil, vias tented up to drill 20mil, thermal gap 10mil
Holes 4 mm at 19.05,76.2 19.05,19.05 304.8,76.2 300.04,19.05 128.59,47.62 204.79,47.62

### Footprints (pad centres in the part's own frame; a part is rotated, then mirrored left to right if it is on the bottom)
QFP80P1200X1200X120-44N = smd 1.473 x 0.508: 1 -5.74,3.988; 2 -5.74,3.2; 3 -5.74,2.388; 4 -5.74,1.6; 5 -5.74,0.787; 6 -5.74,0; 7 -5.74,-0.787; 8 -5.74,-1.6; 9 -5.74,-2.388; 10 -5.74,-3.2; 11 -5.74,-3.988; 23 5.74,-3.988; 24 5.74,-3.2; 25 5.74,-2.388; 26 5.74,-1.6; 27 5.74,-0.787; 28 5.74,0; 29 5.74,0.787; 30 5.74,1.6; 31 5.74,2.388; 32 5.74,3.2; 33 5.74,3.988 | smd 0.508 x 1.473: 12 -3.988,-5.74; 13 -3.2,-5.74; 14 -2.388,-5.74; 15 -1.6,-5.74; 16 -0.787,-5.74; 17 0,-5.74; 18 0.787,-5.74; 19 1.6,-5.74; 20 2.388,-5.74; 21 3.2,-5.74; 22 3.988,-5.74; 34 3.988,5.74; 35 3.2,5.74; 36 2.388,5.74; 37 1.6,5.74; 38 0.787,5.74; 39 0,5.74; 40 -0.787,5.74; 41 -1.6,5.74; 42 -2.388,5.74; 43 -3.2,5.74; 44 -3.988,5.74
0603 = smd 1.1 x 1: 1 -0.85,0; 2 0.85,0
SOD-323 = smd 0.63 x 0.83: A 1.15,0; C -1.15,0
2X3 = drill 1.016 pad 1.88: 1 0,0; 2 0,2.54; 3 2.54,0; 4 2.54,2.54; 5 5.08,0; 6 5.08,2.54
CHERRY-MX-LED = drill 1.092 pad 2.032: A -1.27,-5.08; K 1.27,-5.08 | drill 1.753 pad 3.226: S1 -3.81,2.54; S2 2.54,5.08 | hole 4.089: 0,0 | hole 1.707: -5.08,0; 5.08,0
TACTILE_SWITCH_SMD_5.2MM = smd 1.524 x 0.762: 1 -2.794,1.905; 2 2.794,1.905; 3 -2.794,-1.905; 4 2.794,-1.905
USB_TYPE_C = smd 0.6 x 1.45: A1B12GND -3.25,5.095; A4B9VBUS -2.45,5.095; A9B4VBUS 2.45,5.095; A12B1GND 3.25,5.095 | smd 0.3 x 1.45: A5 -1.25,5.095; A6 -0.25,5.095; A7 0.25,5.095; A8 1.25,5.095; B5 1.75,5.095; B6 0.75,5.095; B7 -0.75,5.095; B8 -1.75,5.095 | drill 0.6 long: P$1 -4.32,0; P$2 4.32,0 | drill 0.6 pad 1 long: P$3 -4.32,4.18; P$4 4.32,4.18 | hole 0.65: -2.89,3.65; 2.89,3.65
CRYSTAL-SMD-5X3.2-4PAD = smd 1.9 x 1.1: 1 -1.85,-1.15; 2 1.85,-1.15; 3 1.85,1.15; 4 -1.85,1.15

### Placement (x,y rotation side)
ATMEGA32U4-AU  166.85,10.95 0 top
C1  214.95,16.67 0 top
C2  211.14,16.67 0 top
C3  207.33,16.67 0 top
C4  203.52,16.67 0 top
D1  314.32,76.2 0 top
D2  295.27,76.2 0 top
D3  276.22,76.2 0 top
D4  257.18,76.2 0 top
D5  238.12,76.2 0 top
D6  219.08,76.2 0 top
D7  200.03,76.2 0 top
D8  180.97,76.2 0 top
D9  161.93,76.2 0 top
D10  142.88,76.2 0 top
D11  123.83,76.2 0 top
D12  104.78,76.2 0 top
D13  85.73,76.2 0 top
D14  66.67,76.2 0 top
D15  47.62,76.2 0 top
D16  28.58,76.2 0 top
D17  9.53,76.2 0 top
D18  314.32,57.15 0 top
D19  295.27,57.15 0 top
D20  276.22,57.15 0 top
D21  257.18,57.15 0 top
D22  238.12,57.15 0 top
D23  219.08,57.15 0 top
D24  200.03,57.15 0 top
D25  180.97,57.15 0 top
D26  161.93,57.15 0 top
D27  142.88,57.15 0 top
D28  123.83,57.15 0 top
D29  104.78,57.15 0 top
D30  85.73,57.15 0 top
D31  66.67,57.15 0 top
D32  47.62,57.15 0 top
D33  28.58,57.15 0 top
D34  9.53,57.15 0 top
D35  311.94,38.1 0 top
D36  290.51,38.1 0 top
D37  271.46,38.1 0 top
D38  252.41,38.1 0 top
D39  233.36,38.1 0 top
D40  214.31,38.1 0 top
D41  195.26,38.1 0 top
D42  176.21,38.1 0 top
D43  157.16,38.1 0 top
D44  138.11,38.1 0 top
D45  119.06,38.1 0 top
D46  92.87,38.1 0 top
D47  66.67,38.1 0 top
D48  47.62,38.1 0 top
D49  28.58,38.1 0 top
D50  9.53,38.1 0 top
D51  307.18,20 0 top
D52  280.99,20 0 top
D53  261.94,20 0 top
D54  242.89,20 0 top
D55  223.84,20 0 top
D56  204.79,20 0 top
D57  185.74,20 0 top
D58  166.69,20 0 top
D59  147.64,20 0 top
D60  128.59,20 0 top
D61  107.16,20 0 top
D62  85.73,20 0 top
D63  66.67,20 0 top
D64  47.62,20 0 top
D65  28.58,20 0 top
D66  9.53,20 0 top
D67  311.94,17.62 0 top
D68  290.51,17.62 0 top
D69  271.46,17.62 0 top
D70  252.41,17.62 0 top
D71  226.22,17.62 0 top
D72  183.36,17.62 0 top
D73  147.64,17.62 0 top
D74  128.59,17.62 0 top
D75  109.54,17.62 0 top
D76  88.11,17.62 0 top
D77  57.15,17.62 0 top
D78  28.58,17.62 0 top
D79  9.53,17.62 0 top
ISP  186.53,38.58 90 top
R1  20.95,82.87 0 top
R2  16.67,82.87 0 top
R3  15.72,80.49 180 top
R4  21.91,80.49 180 top
S1  314.32,85.73 180 bottom
S2  295.27,85.73 180 bottom
S3  276.22,85.73 180 bottom
S4  257.18,85.73 180 bottom
S5  238.12,85.73 180 bottom
S6  219.08,85.73 180 bottom
S7  200.03,85.73 180 bottom
S8  180.97,85.73 180 bottom
S9  161.93,85.73 180 bottom
S10  142.88,85.73 180 bottom
S11  123.83,85.73 180 bottom
S12  104.78,85.73 180 bottom
S13  85.73,85.73 180 bottom
S14  66.67,85.73 180 bottom
S15  47.62,85.73 180 bottom
S16  28.58,85.73 180 bottom
S17  9.53,85.73 180 bottom
S18  314.32,66.67 180 bottom
S19  295.27,66.67 180 bottom
S20  276.22,66.67 180 bottom
S21  257.18,66.67 180 bottom
S22  238.12,66.67 180 bottom
S23  219.08,66.67 180 bottom
S24  200.03,66.67 180 bottom
S25  180.97,66.67 180 bottom
S26  161.93,66.67 180 bottom
S27  142.88,66.67 180 bottom
S28  123.83,66.67 180 bottom
S29  104.78,66.67 180 bottom
S30  85.73,66.67 180 bottom
S31  66.67,66.67 180 bottom
S32  47.62,66.67 180 bottom
S33  28.58,66.67 180 bottom
S34  9.53,66.67 180 bottom
S35  311.94,47.62 180 bottom
S36  290.51,47.62 180 bottom
S37  271.46,47.62 180 bottom
S38  252.41,47.62 180 bottom
S39  233.36,47.62 180 bottom
S40  214.31,47.62 180 bottom
S41  195.26,47.62 180 bottom
S42  176.21,47.62 180 bottom
S43  157.16,47.62 180 bottom
S44  138.11,47.62 180 bottom
S45  119.06,47.62 180 bottom
S46  92.87,47.62 180 bottom
S47  66.67,47.62 180 bottom
S48  47.62,47.62 180 bottom
S49  28.58,47.62 180 bottom
S50  9.53,47.62 180 bottom
S51  307.18,28.58 180 bottom
S52  280.99,28.58 180 bottom
S53  261.94,28.58 180 bottom
S54  242.89,28.58 180 bottom
S55  223.84,28.58 180 bottom
S56  204.79,28.58 180 bottom
S57  185.74,28.58 180 bottom
S58  166.69,28.58 180 bottom
S59  147.64,28.58 180 bottom
S60  128.59,28.58 180 bottom
S61  107.16,28.58 180 bottom
S62  85.73,28.58 180 bottom
S63  66.67,28.58 180 bottom
S64  47.62,28.58 180 bottom
S65  28.58,28.58 180 bottom
S66  9.53,28.58 180 bottom
S67  311.94,9.53 180 bottom
S68  290.51,9.53 180 bottom
S69  271.46,9.53 180 bottom
S70  252.41,9.53 180 bottom
S71  226.22,9.53 180 bottom
S72  183.36,9.53 180 bottom
S73  147.64,9.53 180 bottom
S74  128.59,9.53 180 bottom
S75  109.54,9.53 180 bottom
S76  88.11,9.53 180 bottom
S77  57.15,9.53 180 bottom
S78  28.58,9.53 180 bottom
S79  9.53,9.53 180 bottom
S80  195.26,16.67 90 top
U$1  19.05,93.82 180 top
Y1  157.32,20.8 270 top

### Tracks (layer width: path | path; a pad name or v marks a point on that pad's centre or on a via)
C1  (via drill 0.51)
  Top 0.254: 306.27,17.77 310.77,17.77 D67.C | 306.27,17.77 306.27,19.77 D51.C 306.27,20.02 306.27,23.02 310.02,26.77 310.02,37.27 310.77,38.02 D35.C 311.02,38.27 311.02,42.02 314.77,45.77 314.77,55.52 313.27,57.02 D18.C 313.02,57.27 313.02,64.53 311.52,66.03 311.52,74.53 313.02,76.03 D1.C | v159.53,2.53 159.53,9.28 161.03,9.28 ATMEGA32U4-AU.8 | v293.52,2.03 306.27,14.78 306.27,17.77
  Bottom 0.254: v159.53,2.53 160.03,2.03 168.03,2.03 168.78,1.28 205.03,1.28 205.78,2.03 v293.52,2.03
C2  (via drill 0.51)
  Top 0.254: v163.53,9.53 163.53,8.53 161.28,8.53 ATMEGA32U4-AU.9 | v176.53,9.53 177.78,10.78 177.78,33.52 181.53,37.27 188.03,37.27 188.03,39.02 186.78,40.27 186.78,41.02 ISP.3 | D52.C 280.02,19.77 280.02,17.77 289.27,17.77 D68.C 289.52,17.77 289.52,38.02 D36.C 289.52,38.27 v289.52,40.52 289.52,41.77 293.27,45.52 293.27,56.27 294.02,57.02 D19.C 294.02,57.27 294.02,64.53 292.52,66.03 292.52,74.53 294.02,76.03 D2.C
  Bottom 0.254: v176.53,9.53 v163.53,9.53 | v289.52,40.52 187.28,40.52 186.78,41.02 ISP.3
C3  (via drill 0.51)
  Top 0.254: 270.27,17.77 261.02,17.77 261.02,19.77 D53.C | 270.27,17.77 270.27,38.02 D37.C 270.52,38.27 270.52,42.02 274.27,45.77 274.27,56.27 275.02,57.02 D20.C 275.02,57.27 275.02,64.28 273.52,65.78 273.52,74.53 274.52,75.53 | 270.27,17.77 D69.C | 274.52,75.53 275.02,76.03 D3.C | v162.78,7.53 162.78,7.78 161.28,7.78 ATMEGA32U4-AU.10 | v147.78,6.03 141.28,12.53 v141.28,37.27 | 274.52,75.53 261.77,88.28 202.53,88.28 202.53,83.53 187.28,68.28 187.28,48.77 182.53,44.02 182.53,42.52 183.78,41.27 ISP.4
  Bottom 0.254: v162.78,7.53 162.53,7.78 150.03,7.78 148.28,6.03 v147.78,6.03 | v141.28,37.27 143.53,39.52 182.28,39.52 183.78,41.02 ISP.4
C4  (via drill 0.51)
  Top 0.254: v160.53,5.28 160.53,6.28 161.03,6.78 ATMEGA32U4-AU.11 | v155.78,6.78 154.28,8.28 v154.28,37.27 | D4.C 256.02,76.03 254.53,74.53 254.53,65.78 256.02,64.28 D21.C 256.02,57.02 255.28,56.27 255.28,45.77 251.28,41.77 251.28,38.27 D38.C 251.28,38.02 251.28,17.77 D70.C 251.03,17.77 241.78,17.77 241.78,19.77 D54.C 241.53,20.02 v230.53,31.02
  Bottom 0.254: v160.53,5.28 159.03,6.78 v155.78,6.78 | v154.28,37.27 154.53,37.02 185.03,37.02 186.53,38.52 ISP.1 186.78,38.52 194.28,31.02 v230.53,31.02
C5  (via drill 0.51)
  Top 0.254: D5.C 236.78,76.03 235.28,74.53 235.28,66.03 236.78,64.53 236.78,57.27 D22.C 236.78,57.02 236.78,47.52 233.78,44.52 233.78,39.77 232.28,38.27 D39.C 232.03,38.02 226.28,32.27 226.28,26.27 222.78,22.77 222.78,20.02 D55.C | D55.C 222.78,19.77 225.03,17.52 D71.C | v171.03,11.03 172.53,11.03 ATMEGA32U4-AU.28 | v215.78,13.03 222.53,19.77 D55.C
  Bottom 0.254: v171.03,11.03 171.53,11.53 181.78,11.53 183.28,13.03 v215.78,13.03
C6  (via drill 0.51)
  Top 0.254: v183.53,19.27 183.53,19.02 182.28,17.77 D72.C | v202.53,19.27 203.53,19.27 203.53,19.77 D56.C 203.78,20.02 205.28,21.52 205.28,25.52 208.53,28.77 208.53,33.52 213.03,38.02 D40.C 213.28,38.27 214.78,39.77 214.78,44.52 217.78,47.52 217.78,57.02 D23.C 217.78,57.27 217.78,64.53 216.28,66.03 216.28,74.53 217.78,76.03 D6.C | v176.03,19.27 176.03,13.78 175.03,12.78 175.03,11.78 172.78,11.78 ATMEGA32U4-AU.29
  Bottom 0.254: v202.53,19.27 v183.53,19.27 v176.03,19.27
C7  (via drill 0.51)
  Top 0.254: v163.78,41.52 163.78,37.27 155.53,37.27 155.28,37.52 155.28,38.27 153.78,38.27 151.53,36.02 151.53,29.02 148.03,25.52 148.03,19.27 146.53,17.77 D73.C | 191.78,40.52 194.03,38.27 D41.C 194.03,38.02 194.03,22.02 v194.53,21.52 | 191.78,40.52 v190.78,41.52 | v184.28,21.27 184.28,20.27 184.53,20.02 D57.C | 191.78,40.52 198.03,46.77 198.03,56.27 198.78,57.02 D24.C 198.78,57.27 198.78,64.53 197.28,66.03 197.28,74.53 198.78,76.03 D7.C | v174.53,19.27 174.53,18.52 171.28,15.28 171.28,12.53 172.53,12.53 ATMEGA32U4-AU.30
  Bottom 0.254: v163.78,41.52 165.28,43.02 176.28,43.02 178.28,45.02 187.28,45.02 v190.78,41.52 | v194.53,21.52 184.53,21.52 v184.28,21.27 176.53,21.27 v174.53,19.27
C8  (via drill 0.51)
  Top 0.254: 134.28,18.52 134.53,18.52 134.53,12.78 145.78,1.53 161.53,1.53 161.53,3.78 162.78,5.03 ATMEGA32U4-AU.12 | 134.28,18.52 129.28,18.52 129.03,18.27 129.03,17.77 127.53,17.77 D74.C | v166.03,21.27 166.03,20.27 165.78,20.02 D58.C | v172.78,21.52 175.03,23.77 175.03,38.02 D42.C 175.03,38.27 175.03,41.77 179.78,46.52 179.78,57.02 D25.C 179.78,57.27 179.78,64.28 178.28,65.78 178.28,74.53 179.78,76.03 D8.C | v134.28,20.02 134.28,18.52
  Bottom 0.254: v172.78,21.52 166.28,21.52 v166.03,21.27 135.53,21.27 v134.28,20.02
C9  (via drill 0.51)
  Top 0.254: 156.03,38.27 157.53,39.77 157.53,44.52 160.78,47.77 D26.C 160.78,64.28 159.28,65.78 159.28,74.53 160.78,76.03 D9.C | v109.53,17.77 108.53,17.77 D75.C | v144.53,18.02 146.28,19.77 D59.C 146.28,20.02 146.28,26.52 144.78,28.02 144.78,39.02 155.28,39.02 156.03,38.27 | v175.03,16.52 175.03,13.53 172.78,13.53 ATMEGA32U4-AU.31 | 156.03,38.27 D43.C
  Bottom 0.254: v109.53,17.77 109.78,18.02 v144.53,18.02 145.28,17.27 162.28,17.27 163.03,16.52 v175.03,16.52
C10  (via drill 0.51)
  Top 0.254: D10.C 141.53,76.03 140.03,74.53 140.03,66.03 141.53,64.53 141.53,57.27 D27.C 141.53,57.02 141.53,47.52 138.53,44.52 138.53,39.77 137.03,38.27 D44.C 137.03,38.02 v137.03,19.02 | v88.28,19.02 87.03,17.77 D76.C | v126.53,19.02 127.28,19.77 D60.C | v174.03,15.53 174.03,14.28 172.78,14.28 ATMEGA32U4-AU.32 | v161.78,16.27 160.03,18.02 v160.03,18.27
  Bottom 0.254: v88.28,19.02 v126.53,19.02 v137.03,19.02 159.28,19.02 v160.03,18.27 | v174.03,15.53 173.78,15.78 162.28,15.78 v161.78,16.27
C11  (via drill 0.51)
  Top 0.254: D11.C 122.53,76.03 121.03,74.53 121.03,66.03 122.53,64.53 122.53,57.27 D28.C 122.53,57.02 122.53,47.52 119.53,44.52 119.53,39.77 118.03,38.27 D45.C 117.78,38.02 109.78,30.02 109.78,26.52 106.03,22.77 106.03,20.02 D61.C 105.78,19.77 103.03,17.02 103.03,1.28 | 103.03,1.28 82.28,1.28 65.03,18.52 57.77,18.52 57.52,18.27 57.52,17.77 56.02,17.77 D77.C | v167.53,3.03 167.53,5.03 ATMEGA32U4-AU.18 | v162.53,1.03 v164.53,3.03 | 103.03,1.28 v103.28,1.03
  Bottom 0.254: v164.53,3.03 v167.53,3.03 | v103.28,1.03 v162.53,1.03
C12  (via drill 0.51)
  Top 0.254: D12.C 103.53,76.03 102.03,74.53 102.03,66.03 103.03,65.03 103.03,57.77 103.53,57.27 D29.C 103.53,57.02 95.28,48.77 95.28,45.27 91.78,41.77 91.78,38.27 D46.C 91.53,38.02 88.53,35.02 88.53,26.52 84.78,22.77 84.78,20.02 D62.C 84.53,19.77 84.53,19.02 81.78,19.02 | 81.78,19.02 65.28,19.02 65.03,19.27 56.27,19.27 55.02,18.02 55.02,15.78 49.02,15.78 47.02,17.77 47.02,18.52 29.27,18.52 29.02,18.27 29.02,17.77 27.52,17.77 D78.C | v169.28,2.28 168.53,3.03 168.53,5.03 ATMEGA32U4-AU.19 | v172.28,2.28 173.28,1.28 174.78,1.28 v174.78,5.03 | v86.03,2.28 81.78,6.53 81.78,19.02
  Bottom 0.254: v172.28,2.28 v169.28,2.28 | v174.78,5.03 162.53,5.03 161.78,4.28 157.78,4.28 157.28,4.78 153.28,4.78 150.78,2.28 v86.03,2.28
C13  (via drill 0.51)
  Top 0.254: 84.03,57.77 84.53,57.27 D30.C | 84.03,57.77 84.03,64.78 83.03,65.78 83.03,74.53 84.53,76.03 D13.C | v9.53,17.77 8.53,17.77 D79.C | 65.03,20.52 65.53,20.02 D63.C | 65.03,20.52 v64.03,21.52 | 65.03,20.52 65.03,26.77 64.03,27.77 v64.03,31.02 64.03,36.52 65.53,38.02 D47.C 65.53,44.52 70.78,44.52 84.03,57.77 | v178.53,3.03 178.53,0.53 172.53,0.53 169.28,3.78 169.28,5.03 ATMEGA32U4-AU.20 | v183.78,3.03 184.53,3.03 185.28,2.28 190.28,2.28 190.28,27.27 188.53,29.02 v188.53,29.27
  Bottom 0.254: v9.53,17.77 13.28,21.52 v64.03,21.52 | v183.78,3.03 v178.53,3.03 | v188.53,29.27 186.78,31.02 v64.03,31.02
C14  (via drill 0.51)
  Top 0.254: 65.03,57.77 65.53,57.27 D31.C | 65.03,57.77 65.03,64.78 64.03,65.78 64.03,74.53 65.53,76.03 D14.C | v168.03,11.78 168.53,11.28 168.53,10.03 168.28,9.78 168.28,7.03 169.03,7.03 170.03,6.03 170.03,5.28 ATMEGA32U4-AU.21 | v49.52,16.77 46.52,19.77 D64.C 46.27,20.02 45.77,20.52 45.77,27.02 44.77,28.02 44.77,36.52 46.27,38.02 D48.C 46.52,38.27 46.52,44.52 51.77,44.52 65.03,57.77
  Bottom 0.254: v168.03,11.78 160.28,11.78 159.28,12.78 53.52,12.78 v49.52,16.77
C15  (via drill 0.51)
  Top 0.254: D15.C 46.27,76.03 44.77,74.53 44.77,66.03 45.77,65.03 45.77,57.77 46.27,57.27 D32.C 46.27,57.02 41.02,51.77 41.02,39.02 37.52,35.52 v30.02,35.52 27.52,38.02 D49.C 27.27,38.02 25.77,36.52 25.77,27.77 26.77,26.77 26.77,20.52 27.27,20.02 D65.C | v176.03,4.53 176.03,8.53 172.78,8.53 ATMEGA32U4-AU.25 | v180.03,4.53 181.53,6.03 181.53,7.78 179.53,9.78 179.53,28.02 178.78,28.77 v178.78,33.02
  Bottom 0.254: v180.03,4.53 v176.03,4.53 | v178.78,33.02 176.28,35.52 v30.02,35.52
C16  (via drill 0.51)
  Top 0.254: D66.C 8.28,20.02 7.78,20.52 7.78,26.77 6.78,27.77 6.78,36.52 8.28,38.02 D50.C 8.53,38.27 v9.53,38.27 | D16.C 27.27,76.03 25.77,74.53 25.77,66.03 26.77,65.03 26.77,57.77 27.27,57.27 D33.C 27.52,57.02 31.27,53.27 31.27,48.27 v40.02,39.52 | v173.78,2.28 171.03,5.03 ATMEGA32U4-AU.22 | v187.78,6.03 186.78,7.03 186.78,18.77 185.28,20.27 185.28,25.52 181.78,29.02 v181.78,33.02
  Bottom 0.254: v173.78,2.28 174.03,2.03 186.28,2.03 188.03,3.78 188.03,6.03 v187.78,6.03 | v181.78,33.02 178.53,36.27 92.78,36.27 89.53,39.52 v40.02,39.52 10.78,39.52 v9.53,38.27
C17  (via drill 0.51)
  Top 0.254: D17.C 8.28,76.03 6.78,74.53 6.78,66.03 7.78,65.03 7.78,57.77 8.28,57.27 D34.C 8.53,57.02 12.28,53.27 12.28,48.27 14.03,46.52 14.03,42.02 v15.53,40.52 | v176.03,40.52 176.03,38.02 177.03,37.02 177.03,14.03 175.78,12.78 175.78,10.28 172.78,10.28 ATMEGA32U4-AU.27
  Bottom 0.254: v15.53,40.52 v176.03,40.52
GND  (via drill 0.51)
  Top 0.254: 163.53,13.28 163.53,16.52 ATMEGA32U4-AU.43 | 163.53,13.28 163.53,11.78 161.28,11.78 ATMEGA32U4-AU.5 | v163.28,3.53 163.28,4.03 164.78,4.03 165.28,4.53 165.28,5.03 ATMEGA32U4-AU.15 | v173.53,4.03 172.78,4.78 172.78,6.03 | 172.78,6.03 172.78,6.78 ATMEGA32U4-AU.23 | 172.78,6.03 170.03,8.78 170.03,16.52 ATMEGA32U4-AU.35 | v162.78,13.28 163.53,13.28 | v156.53,13.78 156.78,13.53 v156.78,3.78 152.28,3.78 150.78,2.28 145.78,2.28 135.28,12.78 135.28,23.52 131.03,27.77 131.03,29.52 128.28,32.27 125.78,32.27 125.78,57.27 130.53,62.02 v130.53,66.78 | U$1.A12B1GND 15.78,88.78 13.28,86.28 13.28,83.03 14.87,81.23 R3.2 14.87,79.03 v17.02,79.03 | v19.52,79.03 19.52,79.78 20.24,80.49 R4.2 | v26.77,81.78 26.77,84.03 26.27,84.53 26.27,84.78 22.52,88.53 U$1.A1B12GND | 208.03,17.52 208.03,16.77 C3.2 | 208.03,17.52 208.03,17.77 205.53,17.77 204.53,16.77 C4.2 204.28,16.52 204.28,15.78 202.03,15.78 201.78,16.02 201.78,16.77 196.28,16.77 | 208.03,17.52 211.03,17.52 211.78,16.77 C2.2 212.03,16.52 212.03,15.78 215.03,15.78 215.78,16.52 C1.2 | 196.28,16.77 193.53,14.03 S80.1 | 188.28,45.02 189.28,45.02 189.28,39.27 193.03,35.52 193.03,21.52 196.28,18.27 196.28,16.77 | 188.28,45.02 185.28,45.02 184.03,43.77 ISP.6 | 188.28,45.02 v188.28,65.03
  Bottom 0.254: v173.53,4.03 163.78,4.03 v163.28,3.53 157.03,3.53 v156.78,3.78 | v162.78,13.28 162.53,13.53 156.78,13.53 v156.53,13.78 | v17.02,79.03 v19.52,79.03 24.02,79.03 v26.77,81.78 39.27,69.28 130.53,69.28 | 130.53,69.28 181.78,69.28 186.03,65.03 v188.28,65.03 | 130.53,69.28 v130.53,66.78
  pour Top: 4.76,95.25 319.09,95.25 arc-90 323.85,90.49 323.85,4.76 arc-90 319.09,0 4.76,0 arc-90 0,4.76 0,90.49 arc-90
  pour Bottom: 4.76,95.25 319.09,95.25 arc-90 323.85,90.49 323.85,4.76 arc-90 319.09,0 4.76,0 arc-90 0,4.76 0,90.49 arc-90
N$1
  Top 0.254: D1.A 315.52,76.28 316.77,77.53 316.77,80.53 S1.S2
N$2
  Top 0.254: D2.A 296.52,76.28 297.77,77.53 297.77,80.53 S2.S2
N$3
  Top 0.254: D3.A 277.52,76.28 278.52,77.28 278.52,80.53 S3.S2
N$4
  Top 0.254: D4.A 258.52,76.28 259.52,77.28 259.52,80.53 S4.S2
N$5
  Top 0.254: D5.A 239.28,76.28 240.53,77.53 240.53,80.53 S5.S2
N$6
  Top 0.254: D6.A 220.28,76.28 221.53,77.53 221.53,80.53 S6.S2
N$7
  Top 0.254: D7.A 201.28,76.28 202.53,77.53 202.53,80.53 S7.S2
N$8
  Top 0.254: D8.A 182.28,76.28 183.28,77.28 183.28,80.53 S8.S2
N$9
  Top 0.254: D9.A 163.28,76.28 164.28,77.28 164.28,80.53 S9.S2
N$10
  Top 0.254: D10.A 144.03,76.28 145.28,77.53 145.28,80.53 S10.S2
N$11
  Top 0.254: D11.A 125.03,76.28 126.28,77.53 126.28,80.53 S11.S2
N$12
  Top 0.254: D12.A 106.03,76.28 107.28,77.53 107.28,80.53 S12.S2
N$13
  Top 0.254: D13.A 87.03,76.28 88.03,77.28 88.03,80.53 S13.S2
N$14
  Top 0.254: D14.A 68.03,76.28 69.03,77.28 69.03,80.53 S14.S2
N$15
  Top 0.254: D15.A 48.77,76.28 50.02,77.53 50.02,80.53 S15.S2
N$16
  Top 0.254: D16.A 29.77,76.28 31.02,77.53 31.02,80.53 S16.S2
N$17
  Top 0.254: D17.A 10.78,76.28 12.03,77.53 12.03,80.53 S17.S2
N$18
  Top 0.254: D18.A 315.52,57.27 316.77,58.52 316.77,61.52 S18.S2
N$19
  Top 0.254: D19.A 296.52,57.27 297.77,58.52 297.77,61.52 S19.S2
N$20
  Top 0.254: D20.A 277.52,57.27 278.52,58.27 278.52,61.52 S20.S2
N$21
  Top 0.254: D21.A 258.52,57.27 259.52,58.27 259.52,61.52 S21.S2
N$22
  Top 0.254: D22.A 239.28,57.27 240.53,58.52 240.53,61.52 S22.S2
N$23
  Top 0.254: D23.A 220.28,57.27 221.53,58.52 221.53,61.52 S23.S2
N$24
  Top 0.254: D24.A 201.28,57.27 202.53,58.52 202.53,61.52 S24.S2
N$25
  Top 0.254: D25.A 182.28,57.27 183.28,58.27 183.28,61.52 S25.S2
N$26
  Top 0.254: D26.A 163.28,57.27 164.28,58.27 164.28,61.52 S26.S2
N$27
  Top 0.254: D27.A 144.03,57.27 145.28,58.52 145.28,61.52 S27.S2
N$28
  Top 0.254: D28.A 125.03,57.27 126.28,58.52 126.28,61.52 S28.S2
N$29
  Top 0.254: D29.A 106.03,57.27 107.28,58.52 107.28,61.52 S29.S2
N$30
  Top 0.254: D30.A 87.03,57.27 88.03,58.27 88.03,61.52 S30.S2
N$31
  Top 0.254: D31.A 68.03,57.27 69.03,58.27 69.03,61.52 S31.S2
N$32
  Top 0.254: D32.A 48.77,57.27 50.02,58.52 50.02,61.52 S32.S2
N$33
  Top 0.254: D33.A 29.77,57.27 31.02,58.52 31.02,61.52 S33.S2
N$34
  Top 0.254: D34.A 10.78,57.27 12.03,58.52 12.03,61.52 S34.S2
N$35
  Top 0.254: D35.A 313.27,38.27 314.27,39.27 314.27,42.52 S35.S2
N$36
  Top 0.254: D36.A 291.77,38.27 293.02,39.52 293.02,42.52 S36.S2
N$37
  Top 0.254: D37.A 272.77,38.27 273.77,39.27 273.77,42.52 S37.S2
N$38
  Top 0.254: D38.A 253.78,38.27 254.78,39.27 254.78,42.52 S38.S2
N$39
  Top 0.254: D39.A 234.53,38.27 235.78,39.52 235.78,42.52 S39.S2
N$40
  Top 0.254: D40.A 215.53,38.27 216.78,39.52 216.78,42.52 S40.S2
N$41
  Top 0.254: D41.A 196.53,38.27 197.78,39.52 197.78,42.52 S41.S2
N$42
  Top 0.254: D42.A 177.53,38.27 178.53,39.27 178.53,42.52 S42.S2
N$43
  Top 0.254: D43.A 158.53,38.27 159.53,39.27 159.53,42.52 S43.S2
N$44
  Top 0.254: D44.A 139.28,38.27 140.53,39.52 140.53,42.52 S44.S2
N$45
  Top 0.254: D45.A 120.28,38.27 121.53,39.52 121.53,42.52 S45.S2
N$46
  Top 0.254: D46.A 94.03,38.27 95.28,39.52 95.28,42.52 S46.S2
N$47
  Top 0.254: D47.A 68.03,38.27 69.03,39.27 69.03,42.52 S47.S2
N$48
  Top 0.254: D48.A 48.77,38.27 50.02,39.52 50.02,42.52 S48.S2
N$49
  Top 0.254: D49.A 29.77,38.27 31.02,39.52 31.02,42.52 S49.S2
N$50
  Top 0.254: D50.A 10.78,38.27 12.03,39.52 12.03,42.52 S50.S2
N$51
  Top 0.254: D51.A 308.52,20.02 309.52,21.02 309.52,23.27 S51.S2
N$52
  Top 0.254: D52.A 282.27,20.02 283.52,21.27 283.52,23.27 S52.S2
N$53
  Top 0.254: S53.S2 264.48,21.02 263.48,20.03 D53.A
N$54
  Top 0.254: D54.A 244.28,20.02 245.28,21.02 245.28,23.27 S54.S2
N$55
  Top 0.254: D55.A 225.03,20.02 226.28,21.27 226.28,23.27 S55.S2
N$56
  Top 0.254: D56.A 206.03,20.02 207.28,21.27 207.28,23.27 S56.S2
N$57
  Top 0.254: D57.A 187.03,20.02 188.28,21.27 188.28,23.27 S57.S2
N$58
  Top 0.254: D58.A 168.03,20.02 169.03,21.02 169.03,23.27 S58.S2
N$59
  Top 0.254: D59.A 149.03,20.02 150.03,21.02 150.03,23.27 S59.S2
N$60
  Top 0.254: D60.A 129.78,20.02 131.03,21.27 131.03,23.27 S60.S2
N$61
  Top 0.254: D61.A 108.53,20.02 109.53,21.02 109.53,23.27 S61.S2
N$62
  Top 0.254: D62.A 87.03,20.02 88.03,21.02 88.03,23.27 S62.S2
N$63
  Top 0.254: D63.A 68.03,20.02 69.03,21.02 69.03,23.27 S63.S2
N$64
  Top 0.254: D64.A 48.77,20.02 50.02,21.27 50.02,23.27 S64.S2
N$65
  Top 0.254: D65.A 29.77,20.02 31.02,21.27 31.02,23.27 S65.S2
N$66
  Top 0.254: D66.A 10.78,20.02 12.03,21.27 12.03,23.27 S66.S2
N$67
  Top 0.254: D67.A 313.27,17.52 314.77,16.02 314.77,4.78 314.52,4.53 S67.S2
N$68
  Top 0.254: D68.A 291.77,17.52 293.27,16.02 293.27,4.53 S68.S2
N$69
  Top 0.254: D69.A 272.77,17.52 274.27,16.02 274.27,4.78 274.02,4.53 S69.S2
N$70
  Top 0.254: D70.A 253.78,17.52 255.28,16.02 255.28,4.78 255.03,4.53 S70.S2
N$71
  Top 0.254: D71.A 227.53,17.52 229.03,16.02 229.03,4.78 228.78,4.53 S71.S2
N$72
  Top 0.254: D72.A 184.53,17.52 186.03,16.02 186.03,4.53 S72.S2
N$73
  Top 0.254: D73.A 149.03,17.52 150.28,16.27 150.28,4.53 S73.S2
N$74
  Top 0.254: D74.A 129.78,17.52 131.28,16.02 131.28,4.53 S74.S2
N$75
  Top 0.254: D75.A 110.78,17.52 112.28,16.02 112.28,4.53 S75.S2
N$76
  Top 0.254: D76.A 89.28,17.52 90.78,16.02 90.78,4.53 S76.S2
N$77
  Top 0.254: D77.A 58.52,17.52 59.77,16.27 59.77,4.53 S77.S2
N$78
  Top 0.254: D78.A 29.77,17.52 31.27,16.02 31.27,4.53 S78.S2
N$79
  Top 0.254: D79.A 10.78,17.52 12.28,16.02 12.28,4.53 S79.S2
N$80  (via drill 0.51)
  Top 0.254: v25.77,20.52 22.27,24.02 22.27,67.28 23.73,68.73 23.73,81.07 22.02,82.78 R1.2 | v159.53,16.02 160.03,15.53 160.03,13.78 160.28,13.53 161.03,13.53 ATMEGA32U4-AU.3
  Bottom 0.254: v25.77,20.52 28.52,17.77 108.03,17.77 109.78,16.02 v159.53,16.02
N$81  (via drill 0.51)
  Top 0.254: v16.52,17.77 16.52,77.03 18.52,79.03 18.52,81.78 17.52,82.78 R2.2 | v158.78,11.78 160.03,11.78 160.03,12.28 160.28,12.53 161.03,12.53 ATMEGA32U4-AU.4
  Bottom 0.254: v16.52,17.77 22.27,12.03 158.53,12.03 v158.78,11.78
N$82
  Top 0.254: R1.1 19.8,83.17 U$1.B7 19.8,89.74 19.53,90.01 19.05,90.01 18.8,89.76 U$1.A7
N$84  (via drill 0.51)
  Top 0.254: R2.1 15.82,83.92 v16.67,84.77 | v18.39,86.02 18.3,86.1 18.3,87.15 | 18.3,87.15 U$1.B6 | U$1.A6 19.3,87.4 19.05,87.15 18.3,87.15
  Bottom 0.254: v16.67,84.77 17.91,86.02 v18.39,86.02
N$85  (via drill 0.51)
  Top 0.254: v161.78,5.78 162.28,6.28 162.28,6.53 163.03,6.53 163.53,6.03 163.53,5.28 ATMEGA32U4-AU.13 | v177.03,6.03 181.53,1.53 197.03,1.53 197.03,8.53 | 197.03,8.53 197.03,13.78 S80.3 | 197.03,8.53 192.28,13.28 192.28,35.52 188.53,39.27 188.53,41.77 186.78,43.52 ISP.5
  Bottom 0.254: v161.78,5.78 174.03,5.78 174.28,6.03 v177.03,6.03
N$86  (via drill 0.51)
  Top 0.254: v206.28,1.03 206.28,16.52 C3.1 | v167.53,1.03 166.03,2.53 166.03,5.03 ATMEGA32U4-AU.16 166.03,5.28 166.03,13.28 v165.03,14.28 | v158.53,15.03 158.53,18.77 Y1.3
  Bottom 0.254: v206.28,1.03 205.78,0.53 168.03,0.53 v167.53,1.03 | v158.53,15.03 159.28,14.28 v165.03,14.28
N$87  (via drill 0.51)
  Top 0.254: v209.28,15.53 210.28,16.52 C2.1 | v167.53,10.53 167.03,10.03 167.03,5.28 ATMEGA32U4-AU.17 | v155.28,11.03 155.28,21.77 156.03,22.52 Y1.1
  Bottom 0.254: v209.28,15.53 208.78,16.02 177.53,16.02 173.78,12.28 170.03,12.28 168.28,10.53 v167.53,10.53 155.78,10.53 v155.28,11.03
N$88  (via drill 0.51)
  Top 0.254: R3.1 16.83,80.75 v16.83,81.61 | v20.95,85.25 20.31,85.9 20.31,88.53 U$1.A5 | U$1.A5 | U$1.A5
  Bottom 0.254: v20.95,85.25 20.47,85.25 19.01,83.78 14.83,83.78 10.51,88.1 5.15,88.1 3.26,86.22 3.26,82.89 4.91,81.24 6.52,81.24 8.04,82.77 15.67,82.77 v16.83,81.61
N$89
  Top 0.254: R4.1 21.22,82.03 19.02,82.03 19.02,84.12 17.27,85.87 17.27,88.53 U$1.B5
N$92  (via drill 0.51)
  Top 0.254: v195.03,27.02 195.03,24.27 202.53,16.77 C4.1 | v163.28,32.02 157.53,26.27 157.53,11.53 158.28,10.78 161.03,10.78 ATMEGA32U4-AU.6
  Bottom 0.254: v195.03,27.02 190.03,32.02 v163.28,32.02
R1
  Top 0.254: S15.S1 44.02,83.28 62.77,83.28 S14.S1 63.02,83.28 81.78,83.28 S13.S1 82.03,83.28 100.78,83.28 S12.S1 101.03,83.28 119.78,83.28 S11.S1 120.03,83.28 139.03,83.28 S10.S1 139.28,83.28 158.03,83.28 S9.S1 161.53,79.78 161.53,76.53 164.78,73.28 164.78,67.03 166.53,65.28 166.53,39.27 164.03,36.77 164.03,33.02 164.28,32.77 164.28,27.52 165.03,26.77 165.03,25.27 164.78,25.02 164.78,19.52 165.28,19.02 165.28,16.77 ATMEGA32U4-AU.41 | S4.S1 253.28,83.28 234.53,83.28 S5.S1 234.28,83.28 215.28,83.28 S6.S1 | S3.S1 272.52,83.28 291.27,83.28 S2.S1 291.52,83.28 310.27,83.28 S1.S1 | S8.S1 177.28,83.28 196.03,83.28 S7.S1
  Bottom 0.254: S17.S1 5.78,83.28 24.52,83.28 S16.S1 24.77,83.28 43.77,83.28 S15.S1 | S4.S1 253.53,83.28 272.27,83.28 S3.S1 | S6.S1 215.03,83.28 196.28,83.28 S7.S1 | S8.S1 177.03,83.28 158.28,83.28 S9.S1
R2  (via drill 0.51)
  Top 0.254: v167.53,14.53 166.03,16.02 166.03,16.52 ATMEGA32U4-AU.40 | v172.03,17.52 171.78,17.77 171.78,22.52 174.28,25.02 174.28,42.27 179.03,47.02 179.03,62.27 S25.S1
  Bottom 0.254: S34.S1 5.78,64.03 24.52,64.03 S33.S1 24.77,64.03 43.77,64.03 S32.S1 44.02,64.03 62.77,64.03 S31.S1 63.02,64.03 81.78,64.03 S30.S1 82.03,64.03 100.78,64.03 S29.S1 101.03,64.03 119.78,64.03 S28.S1 120.03,64.03 139.03,64.03 S27.S1 139.28,64.03 158.03,64.03 S26.S1 158.28,64.03 177.03,64.03 S25.S1 177.28,64.03 196.03,64.03 S24.S1 196.28,64.03 215.03,64.03 S23.S1 215.28,64.03 234.28,64.03 S22.S1 234.53,64.03 253.28,64.03 S21.S1 253.53,64.03 272.27,64.03 S20.S1 272.52,64.03 291.27,64.03 S19.S1 291.52,64.03 310.27,64.03 S18.S1 | v167.53,14.53 174.53,14.53 176.03,16.02 176.03,17.52 v172.03,17.52
R3
  Top 0.254: ATMEGA32U4-AU.39 167.03,16.77 167.03,25.52 172.28,30.77 172.28,45.02 S42.S1
  Bottom 0.254: S35.S1 308.02,45.02 286.77,45.02 S36.S1 286.52,45.02 267.77,45.02 S37.S1 267.52,45.02 248.78,45.02 S38.S1 248.53,45.02 229.78,45.02 S39.S1 229.53,45.02 210.53,45.02 S40.S1 210.28,45.02 191.53,45.02 S41.S1 191.28,45.27 190.78,45.77 177.78,45.77 177.03,45.02 172.53,45.02 S42.S1 172.28,45.02 153.53,45.02 S43.S1 153.28,45.02 134.53,45.02 S44.S1 134.28,45.02 115.28,45.02 S45.S1 115.03,45.02 89.28,45.02 S46.S1 89.03,45.02 63.02,45.02 S47.S1 62.77,45.02 44.02,45.02 S48.S1 43.77,45.02 24.77,45.02 S49.S1 24.52,45.02 5.78,45.02 S50.S1
R4  (via drill 0.51)
  Top 0.254: v170.03,20.27 167.78,18.02 167.78,16.77 ATMEGA32U4-AU.38
  Bottom 0.254: S66.S1 5.78,26.02 24.52,26.02 S65.S1 43.77,26.02 S64.S1 44.02,26.02 62.77,26.02 S63.S1 63.02,26.02 81.78,26.02 S62.S1 82.03,26.02 103.28,26.02 S61.S1 103.53,26.02 S60.S1 125.03,26.02 143.78,26.02 S59.S1 144.03,26.02 162.78,26.02 S58.S1 163.03,26.02 163.53,25.52 180.03,25.52 | v170.03,20.27 170.28,20.52 175.03,20.52 180.03,25.52 | 180.03,25.52 180.53,26.02 181.78,26.02 S57.S1 182.03,26.02 200.78,26.02 S56.S1 201.03,26.02 S55.S1 220.28,26.02 239.03,26.02 S54.S1 239.28,26.02 258.02,26.02 S53.S1 258.27,26.02 277.02,26.02 S52.S1 277.27,26.02 303.27,26.02 S51.S1
R5  (via drill 0.51)
  Top 0.254: v169.28,8.03 169.28,12.03 168.53,12.78 168.53,16.52 ATMEGA32U4-AU.37
  Bottom 0.254: S67.S1 308.02,7.03 286.77,7.03 S68.S1 286.52,7.03 267.77,7.03 S69.S1 267.52,7.03 248.78,7.03 S70.S1 248.53,7.03 222.53,7.03 S71.S1 222.28,7.03 179.78,7.03 S72.S1 179.53,7.03 178.53,8.03 v169.28,8.03 168.78,8.53 155.53,8.53 153.28,10.78 152.28,10.78 148.53,7.03 144.03,7.03 S73.S1 143.78,7.03 125.03,7.03 S74.S1 124.78,7.03 105.78,7.03 S75.S1 105.53,7.03 84.53,7.03 S76.S1 84.28,7.03 53.52,7.03 S77.S1 53.27,7.03 24.77,7.03 S78.S1 24.52,7.03 5.78,7.03 S79.S1
VCC  (via drill 0.51)
  Top 0.254: 164.53,10.53 163.03,10.53 162.78,10.28 161.28,10.28 ATMEGA32U4-AU.7 | 164.53,10.53 v164.53,7.03 164.53,5.28 ATMEGA32U4-AU.14 | v174.28,7.03 174.28,7.78 172.78,7.78 ATMEGA32U4-AU.24 | ATMEGA32U4-AU.2 161.28,14.28 162.78,14.28 162.78,16.52 ATMEGA32U4-AU.44 163.03,16.77 v163.03,19.27 | v212.53,18.27 214.03,16.77 C1.1 | ATMEGA32U4-AU.34 170.78,16.77 v170.78,18.52 171.03,18.77 171.03,22.52 173.28,24.77 v173.28,38.02 | 164.53,10.53 165.03,11.03 v165.03,12.78 | 21.27,90.5 17.5,90.5 16.77,89.78 16.77,88.78 U$1.A9B4VBUS | U$1.A4B9VBUS 21.52,88.78 21.52,89.53 21.27,89.78 21.27,90.5 | 21.27,90.5 21.27,90.53 23.02,92.28 174.53,92.28 174.53,82.78 181.28,76.03 181.28,74.78 183.78,72.28 183.78,64.78 181.28,62.27 181.28,49.52 182.53,48.27 182.53,44.77 181.78,44.02 181.78,40.77 183.78,38.77 ISP.2
  Bottom 0.254: v164.53,7.03 v174.28,7.03 | 179.03,18.27 172.78,18.27 172.53,18.52 v170.78,18.52 170.03,19.27 v163.03,19.27 | 179.03,18.27 v212.53,18.27 | v165.03,12.78 165.78,13.53 174.28,13.53 179.03,18.27 | v173.28,38.02 173.78,38.52 183.78,38.52 ISP.2